# EAGLE design lipoWing (EAGLE 6.6.0)
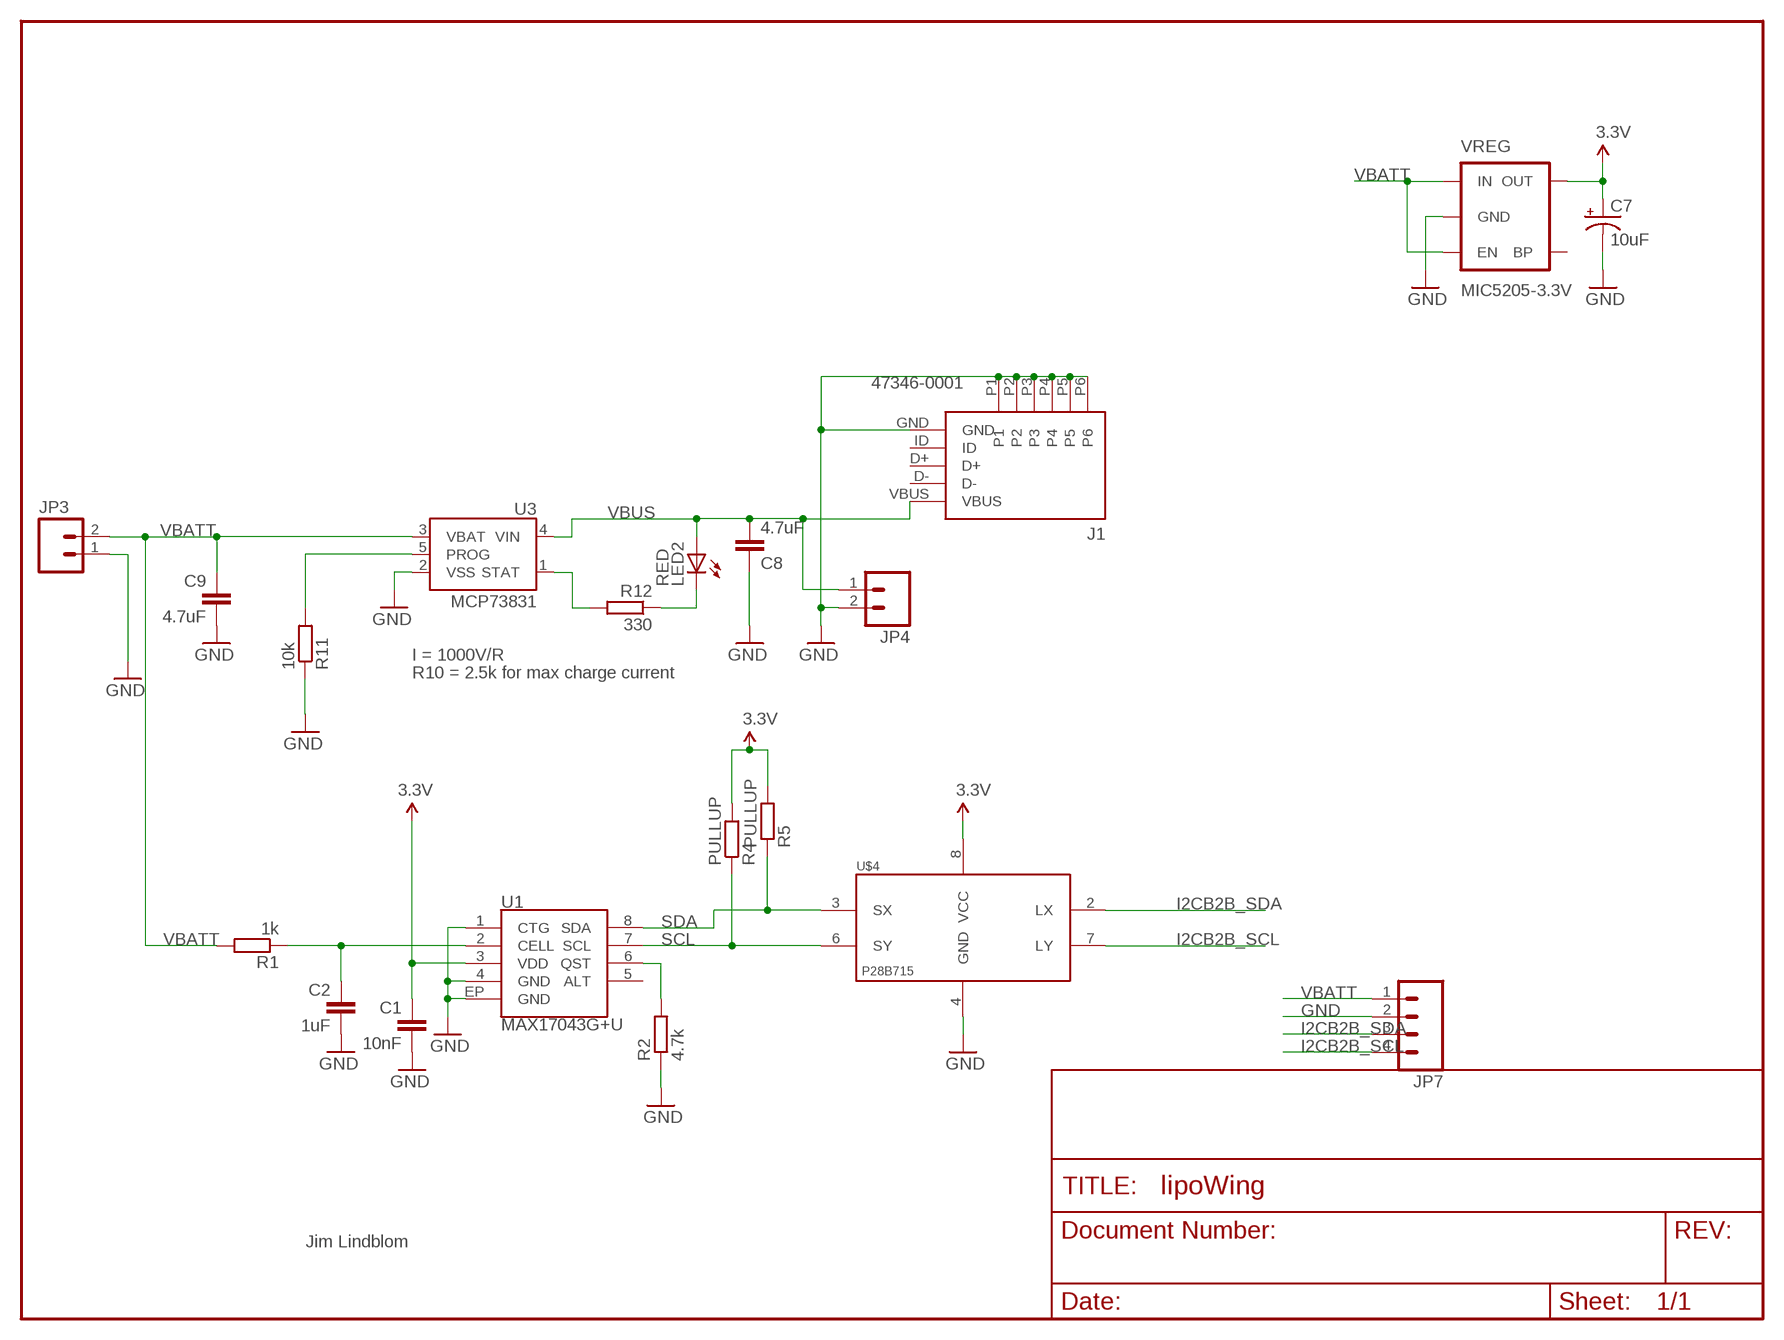
[diagram p0: schematic, sheet 1]

## Parts
C1  10nF  C0603  [C0603]
C2  1uF  C0603  [C0603]
C7  10uF  CAP_POL1206  [EIA3216]
C8  4.7uF  C0603  [C0603]
C9  4.7uF  C0603  [C0603]
J1  47346-0001  MICRO-USB  [MICRO_USB]
JP3  M021X02_NO_SILK  [1X02_NO_SILK]
JP4  M021X02_NO_SILK  [1X02_NO_SILK]
JP7  M04JST  [1X04-1.5MM_JST]
LED2  RED  LED0603  [LED-0603]
R1  1k  R0603  [R0603]
R2  4.7k  R0603  [R0603]
R4  PULLUP  R0603  [R0603]
R5  PULLUP  R0603  [R0603]
R11  10k  R0603  [R0603]
R12  330  R0603  [R0603]
U1  MAX17043G+U  MAX1704X  [TDFN-8]
U3  MCP73831  [SOT23-5]
U$4  P82B715  [SO8]
VREG  MIC5205-3.3V  V_REG_LDOSMD  [SOT23-5]

## Nets
3.3V: C1.1 C7.A(+) R4.2 R5.2 U1.3(VDD) U$4.8(VCC) VREG.5(OUT)
CELL: C2.1 R1.1 U1.2(CELL)
GND: C1.2 C2.2 C7.C(-) C8.1 C9.2 J1.GND J1.P1 J1.P2 J1.P3 J1.P4 J1.P5 J1.P6 JP3.1 JP4.2 JP7.2 R2.1 R11.1 U1.1(CTG) U1.4(GND) U1.EP(GND) U3.2(VSS) U$4.4(GND) VREG.2(GND)
I2CB2B_SCL: JP7.4 U$4.7(LY)
I2CB2B_SDA: JP7.3 U$4.2(LX)
N$5: LED2.C R12.1
PROG: R11.2 U3.5(PROG)
QST: R2.2 U1.6(QST)
SCL: R4.1 U1.7(SCL) U$4.6(SY)
SDA: R5.1 U1.8(SDA) U$4.3(SX)
STAT: R12.2 U3.1(STAT)
VBATT: C9.1 JP3.2 JP7.1 R1.2 U3.3(VBAT) VREG.1(IN) VREG.3(EN)
VBUS: C8.2 J1.VBUS JP4.1 LED2.A U3.4(VIN)
Unconnected: J1.D+ J1.D- J1.ID U1.5(ALT) VREG.4(BP)

## Notes on the sheet
- I = 1000V/R
- R10 = 2.5k for max charge current
- Jim Lindblom

## Library data of the parts
C1 C2 C8 C9 = ELL-i-Passives:C: Surface Mount Capasitors — in standard sizes A capacitor used to store energy electrostatically in an electric field. If you need a high-value capacitor, consider using a polarised capacitor to save space. Wikipedia article on capacitors <https://en.wikipedia.org/wiki/Capacitor>
C7 = SparkFun-Capacitors:CAP_POL: Capacitor Polarized These are standard SMD and PTH capacitors. Normally 10uF, 47uF, and 100uF in electrolytic and tantalum varieties. Always verify the external diameter of the through hole cap, it varies with capacity, voltage, and manufacturer. The EIA devices should be standard.
J1 = ELL-i-Connectors:MICRO-USB: Micro USB from Molex CONN RCPT 5POS MICRO USB R/A Datasheet <http://www.molex.com/pdm_docs/sd/473460001_sd.pdf>; PARTNO: AS-ITM-00021
JP3 JP4 = SparkFun:M02: Header 2 Standard 2-pin 0.1" header. Use with straight break away headers (SKU : PRT-00116), right angle break away headers (PRT-00553), swiss pins (PRT-00743), machine pins (PRT-00117), and female headers (PRT-00115). Molex polarized connector foot print use with SKU : PRT-08233 with associated crimp pins and housings.
JP7 = SparkFun-Connectors:M04: Header 4 Standard 4-pin 0.1" header. Use with straight break away headers (SKU : PRT-00116), right angle break away headers (PRT-00553), swiss pins (PRT-00743), machine pins (PRT-00117), and female headers (PRT-00115). Molex polarized connector foot print use with SKU : PRT-08231 with associated crimp pins and housings. 1MM SMD Version SKU: PRT-10208; OC_NEWARK: unknown
LED2 = SparkFun:LED: LEDs Standard schematic elements and footprints for 5mm, 3mm, 1206, and 0603 sized LEDs. 5mm - Spark Fun Electronics SKU : COM-00529 (and others)
R1 R2 R4 R5 R11 R12 = ELL-i-Passives:R: Surface Mount Resistor — in standard sizes
U1 = SparkFun:MAX1704X: MAX17043/MAX17044: Battery Fuel Guage (43 is 1cell, 44 is 2cell)
U3 = SparkFun:MCP73831: Microchip's MCP73831 Miniature single cell, fully integrated Li-Ion, Li-polymer charge management controller http://ww1.microchip.com/downloads/en/DeviceDoc/21984a.pdf
U$4 = Sensors:P82B715; OC_NEWARK: unknown
VREG = SparkFun:V_REG_LDO: Voltage Regulator LDO Standard 150mA LDO voltage regulator in SOT-23 layout. Micrel part MIC5205. BP (by-pass) pin is used to lower output noise with 470pF cap.

## Board
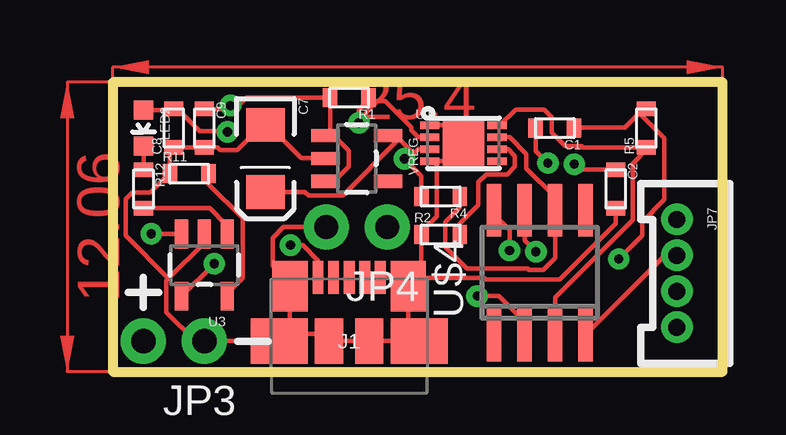
[diagram p1: board, top side]
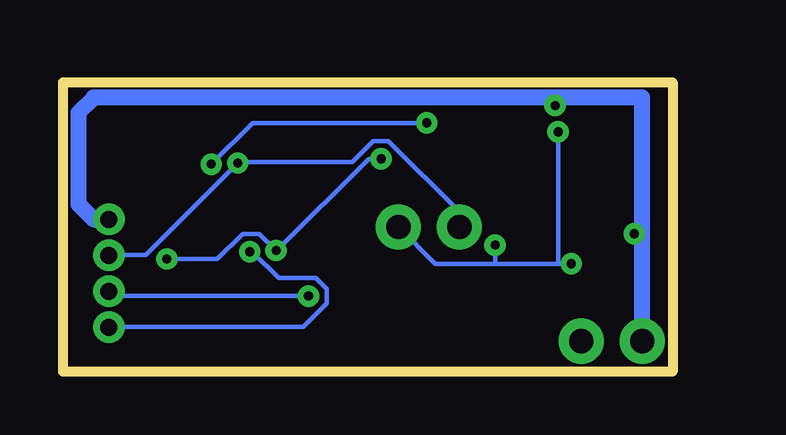
[diagram p2: board, bottom side, seen from below]

Size 25.4 x 12.06 mm. Coordinates in mm from the lower left corner, seen from the top.
Outline: 0,0 25.4,0 25.4,12.06 0,12.06 0,0
Copper layers (1*16): Top 0.035mm / dielectric 1.5mm / Bottom 0.035mm
Design rules "SparkFun": minimum track width 7mil, minimum drill 15mil, track to track 8mil, track to pad 8mil, pad to pad 8mil, via to via 8mil, smd to smd 8mil, copper to edge 8mil, drill to drill 8mil, minimum pad ring 12mil, minimum via ring 10mil, stop-mask expansion 4mil, vias tented up to drill 20mil, thermal gap 10mil

### Footprints (pad centres in the part's own frame; a part is rotated, then mirrored left to right if it is on the bottom)
C0603 = smd 0.6 x 0.8: 1 -0.8,0; 2 0.8,0
EIA3216 = smd 1.4 x 1.6: A 1.4,0; C -1.4,0
MICRO_USB = smd 1.38 x 0.45: D+ 2.66,0; D- 2.66,0.65; GND 2.66,-1.3; ID 2.66,-0.65; VBUS 2.66,1.3 | smd 2.1 x 1.475: P1 2.3,-2.462; P2 2.3,2.462 | smd 1.9 x 2.375: P3 0,2.913; P4 0,-2.913 | smd 1.9 x 1.175: P5 0,0.838; P6 0,-0.838
1X02_NO_SILK = drill 1.016 pad 1.88: 1 0,0; 2 2.54,0
1X04-1.5MM_JST = drill 0.7: 1 0,0; 2 1.5,0; 3 3,0; 4 4.5,0
LED-0603 = smd 0.8 x 0.8: A 0,-0.75; C 0,0.75
R0603 = smd 0.6 x 0.8: 1 -0.8,0; 2 0.8,0
TDFN-8 = smd 0.8 x 0.3: 1 -1.4,0.75; 2 -1.4,0.25; 3 -1.4,-0.25; 4 -1.4,-0.75; 5 1.4,-0.75; 6 1.4,-0.25; 7 1.4,0.25; 8 1.4,0.75 | smd 1.73 x 1.88: EP 0,0
SOT23-5 = smd 0.55 x 1.2: 1 -0.95,-1.3; 2 0,-1.3; 3 0.95,-1.3; 4 0.95,1.3; 5 -0.95,1.3
SO8 = smd 0.6 x 2.2: 1 -1.905,-2.6; 2 -0.635,-2.6; 3 0.635,-2.6; 4 1.905,-2.6; 5 1.905,2.6; 6 0.635,2.6; 7 -0.635,2.6; 8 -1.905,2.6

### Placement (x,y rotation side)
C1  18.41,10.16 180 top
C2  20.95,7.62 270 top
C7  6.35,8.89 270 top
C8  2.54,10.16 90 top
C9  3.81,10.16 270 top
J1  9.84,1.27 90 top
JP3  3.81,1.27 180 top
JP4  11.43,6.03 180 top
JP7  23.5,6.35 270 top
LED2  1.27,10.16 180 top
R1  9.84,11.43 180 top
R2  13.65,5.71 0 top
R4  13.65,7.3 180 top
R5  22.23,10.16 90 top
R11  3.17,8.26 0 top
R12  1.27,7.62 270 top
U1  14.61,9.53 0 top
U3  3.81,4.45 180 top
U$4  17.78,4.13 0 top
VREG  10.16,8.89 270 top

### Tracks (layer width: path | path; a pad name or v marks a point on that pad's centre or on a via)
3.3V  (via drill 0.38)
  Top 0.178: 12.45,8.88 12.45,9 12.54,9.09 | 12.45,8.88 12.45,8.55 12.85,8.15 12.85,7.33 R4.2 | 12.54,9.09 12.72,9.28 U1.3 | 12.54,9.09 11.78,9.85 11.47,9.85 VREG.5 11.88,9.65 9.57,7.35 8.15,7.35 8,7.5 6.38,7.5 C7.A | C1.1 19.23,10.18 21.32,10.18 22.1,10.95 22.2,10.95 R5.2 22,10.72 22.98,9.75 22.98,7.17 22.05,6.25 22.05,5.67 v21.07,4.7 | v16.52,5.05 16.52,5.9 15.88,6.55 U$4.8 | v12.15,8.88 12.45,8.88
  Bottom 0.178: v21.07,4.7 18.98,4.7 17.93,5.75 17.23,5.75 v16.52,5.05 16.45,5.1 12.68,8.88 v12.15,8.88
CELL  (via drill 0.38)
  Top 0.178: v19.23,8.65 19.45,8.43 C2.1 | v10.25,10.38 10.25,10.93 10.65,11.32 R1.1 10.72,11.28 11.35,11.28 12.43,10.2 12.43,10.07 12.72,9.78 U1.2
  Bottom 0.178: v19.23,8.65 17.5,10.38 v10.25,10.38
GND  (via drill 0.38)
  Top 0.178: VREG.2 7.85,8.9 6.45,10.3 6.38,10.3 C7.C 6.28,10.3 6.22,10.3 5.17,9.25 4.47,9.25 4.38,9.35 3.88,9.35 C9.2 2.62,9.35 C8.1 2.52,9.35 2.45,9.35 2.38,9.28 R11.1 2.3,8.22 1.55,7.47 0.8,7.47 0.53,7.2 0.53,5.67 2.31,3.89 | 2.31,3.89 2.23,3.8 2.23,2.48 3.42,1.27 JP3.1 3.9,1.27 6.85,1.27 J1.P3 | 2.31,3.89 3.8,5.38 3.8,5.72 U3.2 | v18.12,8.7 17.62,9.2 17.62,10.15 C1.2 | U$4.4 19.7,1.55 22.98,4.83 23.48,4.83 JP7.2 | J1.P3 6.95,1.27 7.03,1.27 7.38,1.62 7.38,3.55 J1.P2 7.4,3.65 6.65,4.4 6.65,5.58 7.1,6.03 8.88,6.03 JP4.2 | J1.P3 7.45,1.57 8.8,1.57 9.03,1.35 J1.P5 9.03,1.27 J1.P6 10.75,1.27 J1.P4 12.3,1.35 12.3,3.5 J1.P1 | U1.1 13.95,10.28 14.62,9.6 U1.EP 14.6,9.5 14.6,9.43 13.95,8.78 U1.4 13.5,8.7 13.5,6.47 12.82,5.8 R2.1 12.85,4.22 12.3,3.67 J1.P1 | C2.2 20.95,6.8 20.95,6.17 18.62,3.85 15.53,3.85 15.47,3.9 12.65,3.9 J1.P1 | J1.GND 12.43,3.92 J1.P1
  Bottom 0.178: JP7.2 23.48,4.88 21.95,4.88 v18.12,8.7 18.05,8.75 13.35,8.75 12.47,9.62 11.85,9.62 8.9,6.67 8.9,6.05 JP4.2
I2CB2B_SCL  (via drill 0.38)
  Top 0.178: v17.62,5 17.15,5.47 U$4.7
  Bottom 0.178: v17.62,5 17.52,5 16.43,3.9 14.88,3.9 14.43,3.45 14.43,2.85 15.4,1.88 23.48,1.88 JP7.4
I2CB2B_SDA  (via drill 0.38)
  Top 0.178: v15.18,3.15 16.07,3.15 17.15,2.08 17.15,1.55 U$4.2
  Bottom 0.178: v15.18,3.15 23.3,3.15 23.48,3.33 JP7.3
N$5
  Top 0.178: R12.1 LED2.C
PROG
  Top 0.178: R11.2 3.98,7.83 5.4,6.4 5.4,3.9 4.75,3.25 U3.5
QST
  Top 0.178: U1.6 16.48,9.28 16.75,9 16.75,8.55 16.43,8.22 15.55,8.22 15.22,7.9 15.22,6.95 14.45,6.17 14.45,5.72 R2.2
SCL
  Top 0.178: R4.1 14.45,6.85 13.85,6.25 13.85,5.2 14.75,4.3 17.27,4.3 17.32,4.25 17.93,4.25 18.43,4.75 U$4.6 18.43,6.8 18.43,7.28 17.23,8.47 17.23,9.07 16.52,9.78 U1.7
SDA
  Top 0.178: U1.8 16.12,10.28 16.77,10.93 17.98,10.93 18.27,10.62 18.27,9.97 18.85,9.4 19.52,9.4 19.57,9.35 22.2,9.35 R5.1 22.25,9.28 21.65,8.68 21.65,6.33 18.43,3.1 18.43,1.55 U$4.3
STAT
  Top 0.178: R12.2 4.03,6.83 4.75,6.1 U3.1
VBATT  (via drill 0.38)
  Top 0.178: VREG.3 8.88,7.95 9.22,7.95 9.82,8.55 9.82,9.22 9.2,9.85 8.88,9.85 VREG.1 9.05,9.93 9.05,11.35 R1.2 9.03,11.43 5.55,11.43 5.08,10.95 4.9,10.95 | v1.6,5.75 U3.3 | 4.9,10.95 3.83,10.95 C9.1 | v4.9,11.1 4.9,10.95
  Bottom 0.178: v1.6,5.75 1.27,5.75 | v4.9,11.1 4.9,11.43
  Bottom 0.66: JP3.2 1.27,5.75 1.27,11.43 4.9,11.43 24.13,11.43 24.77,10.79 24.77,6.99 24.13,6.35 JP7.1
VBUS  (via drill 0.38)
  Top 0.178: LED2.A 2.38,10.9 2.42,10.95 2.52,10.95 C8.2 2.62,10.95 2.7,10.95 3.62,10.03 4.75,10.03 v4.78,10 | v4.22,4.5 2.88,3.15 U3.4 | v7.4,5.28 7.9,5.28 8.55,4.62 8.55,3.95 J1.VBUS
  Bottom 0.178: 7.4,4.5 9.9,4.5 JP4.1 | 7.4,4.5 4.78,4.5 | 4.78,4.5 v4.22,4.5 | 4.78,4.5 v4.78,10 | 7.4,4.5 v7.4,5.28
(copper drawn outside any net)
  shapes: Top area x2